# EAGLE design Pawmeat_Ton (EAGLE 9.6.2)
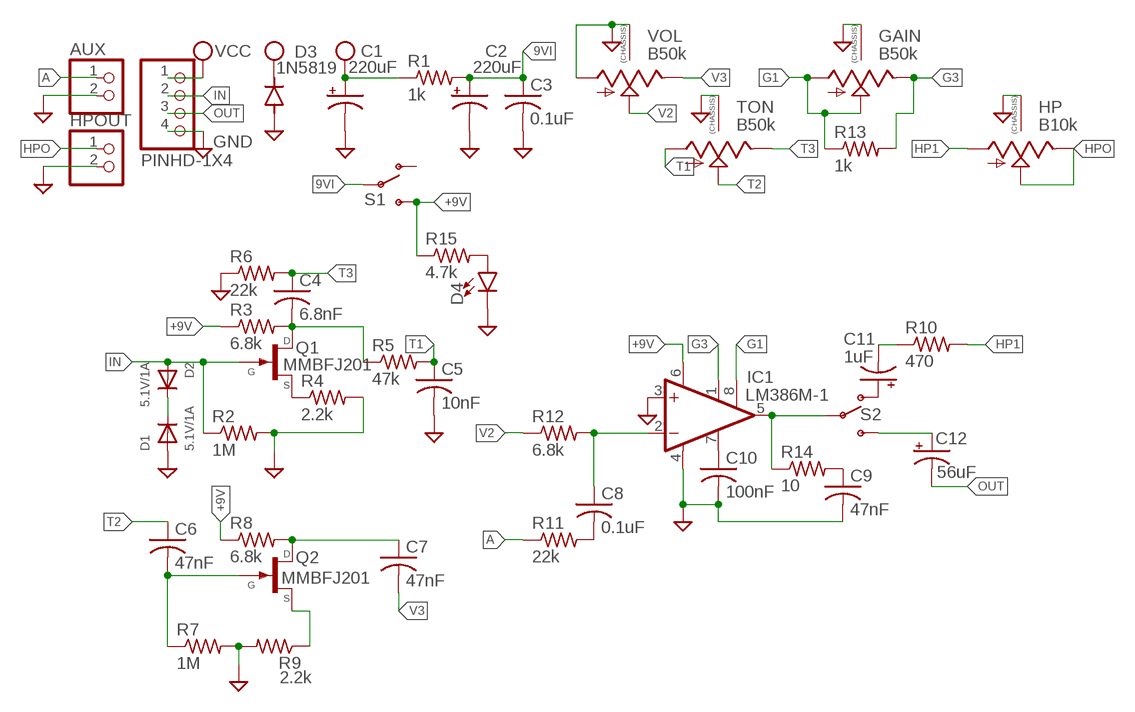
[diagram p0: schematic, sheet 1]

## Parts
AUX  PINHD-1X2  [1X02]
C1  220uF  CAP_SMD+THRUPAN_B  [PAN_B_SMD+THRU]
C2  220uF  CAP_SMD+THRUPAN_B  [PAN_B_SMD+THRU]
C3  0.1uF  C-USC0402  [C0402]
C4  6.8nF  C-USC0402  [C0402]
C5  10nF  C-USC0402  [C0402]
C6  47nF  C-USC0402  [C0402]
C7  47nF  C-USC0402  [C0402]
C8  0.1uF  C-USC0402  [C0402]
C9  47nF  C-USC0402  [C0402]
C10  100nF  C-USC0402  [C0402]
C11  1uF  CAP_SMD+THRUPAN_B  [PAN_B_SMD+THRU]
C12  56uF  CAP_SMD+THRUPAN_B  [PAN_B_SMD+THRU]
D1  5.1V/1A  DIODESMA  [SMADIODE]
D2  5.1V/1A  DIODESMA  [SMADIODE]
D3  1N5819  DIODE-SOD123  [SOD123]
D4  LED0603  [LED-0603]
GAIN  B50k  9MM_SNAP-IN_POT_CHASSIS  [9MM_SNAP-IN_POT]
HP  B10k  9MM_SNAP-IN_POT_CHASSIS  [9MM_SNAP-IN_POT]
HPOUT  PINHD-1X2  [1X02]
IC1  LM386M-1  [SO08]
JP1  PINHD-1X4  [1X04]
Q1  MMBFJ201  MMBF5457  [SOT23]
Q2  MMBFJ201  MMBF5457  [SOT23]
R1  1k  R-US_R0402  [R0402]
R2  1M  R-US_R0402  [R0402]
R3  6.8k  R-US_R0402  [R0402]
R4  2.2k  R-US_R0402  [R0402]
R5  47k  R-US_R0402  [R0402]
R6  22k  R-US_R0402  [R0402]
R7  1M  R-US_R0402  [R0402]
R8  6.8k  R-US_R0402  [R0402]
R9  2.2k  R-US_R0402  [R0402]
R10  470  R-US_R0402  [R0402]
R11  22k  R-US_R0402  [R0402]
R12  6.8k  R-US_R0402  [R0402]
R13  1k  R-US_R0402  [R0402]
R14  10  R-US_R0402  [R0402]
R15  4.7k  R-US_R0402  [R0402]
S1  SWITCH-SPDTSMD2  [SWITCH-SPDT-SMD]
S2  SWITCH-SPDTSMD2  [SWITCH-SPDT-SMD]
TON  B50k  9MM_SNAP-IN_POT_CHASSIS  [9MM_SNAP-IN_POT]
VOL  B50k  9MM_SNAP-IN_POT_CHASSIS  [9MM_SNAP-IN_POT]

## Nets
9VI: C2.+ C2.++(+) C3.1 R1.2 S1.2(P)
+9V: IC1.6(VS) R3.1 R8.1 R15.1 S1.3(S)
A: AUX.1 R11.1
G1: GAIN.1(A) GAIN.2(S) IC1.8(GAIN) R13.1
G3: GAIN.3(E) IC1.1(GAIN) R13.2
GND: AUX.2 C1.- C1.--(-) C2.- C2.--(-) C3.2 C5.2 C9.2 C10.2 D1.A D3.A D4.C GAIN.CHASSIS1 GAIN.CHASSIS2 HP.CHASSIS1 HP.CHASSIS2 HPOUT.2 IC1.3(+IN) IC1.4(GND) JP1.4 R2.2 R4.2 R6.1 R7.2 R9.2 TON.CHASSIS1 TON.CHASSIS2 VOL.1(A) VOL.CHASSIS1 VOL.CHASSIS2
HP1: HP.1(A) R10.2
HPO: HP.2(S) HP.3(E) HPOUT.1
IN: D2.A JP1.2 Q1.3(G) R2.1
N$1: C4.2 Q1.1(D) R3.2 R5.1
N$2: D1.C D2.C
N$3: Q1.2(S) R4.1
N$4: C6.2 Q2.3(G) R7.1
N$5: Q2.2(S) R9.1
N$6: C7.1 Q2.1(D) R8.2
N$7: C8.2 R11.2
N$8: C8.1 IC1.2(-IN) R12.2
N$9: C10.1 IC1.7(BYPASS)
N$10: C9.1 R14.2
N$11: C12.+ C12.++(+) S2.3(S)
N$12: IC1.5(OUT) R14.1 S2.2(P)
N$13: C11.+ C11.++(+) S2.1(O)
N$14: C11.- C11.--(-) R10.1
N$15: D4.A R15.2
OUT: C12.- C12.--(-) JP1.3
T1: C5.1 R5.2 TON.1(A)
T2: C6.1 TON.2(S)
T3: C4.1 R6.2 TON.3(E)
V2: R12.1 VOL.2(S)
V3: C7.2 VOL.3(E)
VCC: C1.+ C1.++(+) D3.C JP1.1 R1.1
Unconnected: S1.1(O)

## Library data of the parts
AUX HPOUT = pinhead:PINHD-1X2: PIN HEADER
C1 C2 C11 C12 = MusicThingModular:CAP_SMD+THRU
C3-C10 = adafruit:C-US: CAPACITOR, American symbol
D1 D2 = adafruit:DIODE: Diode SMADIODE - SMA Surface Mount Package 20V 1A Schottky Diode Digikey: 641-1014-6-ND DO-1N4148 - Through Hole Small Current Diode SOD-123 20V 1 A (.5mV Vf) Schottky Diode - Digikey: MBRX120TPMSCT-ND SOD-323 10V 570mA (.38mV Vf, 3ns) Schottky Diode - Digikey: ZLLS410CT-ND SOD-523 30V 30mA Schottky Diode (RB751S-40TE61) - Digikey: RB751S-40TE61CT-ND SOT23-R/W - SOT23 Package (R = Solder Paste/Reflow Ovens, W = Hand-Soldering) BAT54Film 40V 300mA - Digikey: 497-7162-1-ND
D3 = diode:DIODE-: DIODE
D4 = SparkFun-LED:LED: LED (Generic) Standard schematic elements and footprints for 5mm, 3mm, 1206, and 0603 sized LEDs. Generic LEDs with no color specified.
GAIN HP TON VOL = MusicThingModular:9MM_SNAP-IN_POT_CHASSIS: 9mm vertical snap-in pot, Alpha / Panasonic style, with a connection to the metal chassis for grounding
IC1 = linear:LM386?-*: Low Voltage Audio Power Amplifier Source: http://cache.national.com/ds/LM/LM386.pdf
JP1 = Connector:PINHD-1X4: PIN HEADER; CATEGORY: CONNECTOR; SUB-CATEGORY: PIN-HEADER
Q1 Q2 = MMBF5457:MMBF5457*: N-Channel JFET; AVAILABILITY: Unavailable; DESCRIPTION: JFET N-Channel 25V 350mW Surface Mount SOT-23-3; MF: ON Semiconductor; MP: MMBF5457; PACKAGE: SOT-23-3 Fairchild Semiconductor; PRICE: None
R1-R15 = adafruit:R-US_: RESISTOR, American symbol
S1 S2 = SparkFun-Electromechanical:SWITCH-SPDT: SPDT Switch Simple slide switch, Spark Fun Electronics SKU : COM-00102 DPDT SMT slide switch, AYZ0202, SWCH-08179

## Board
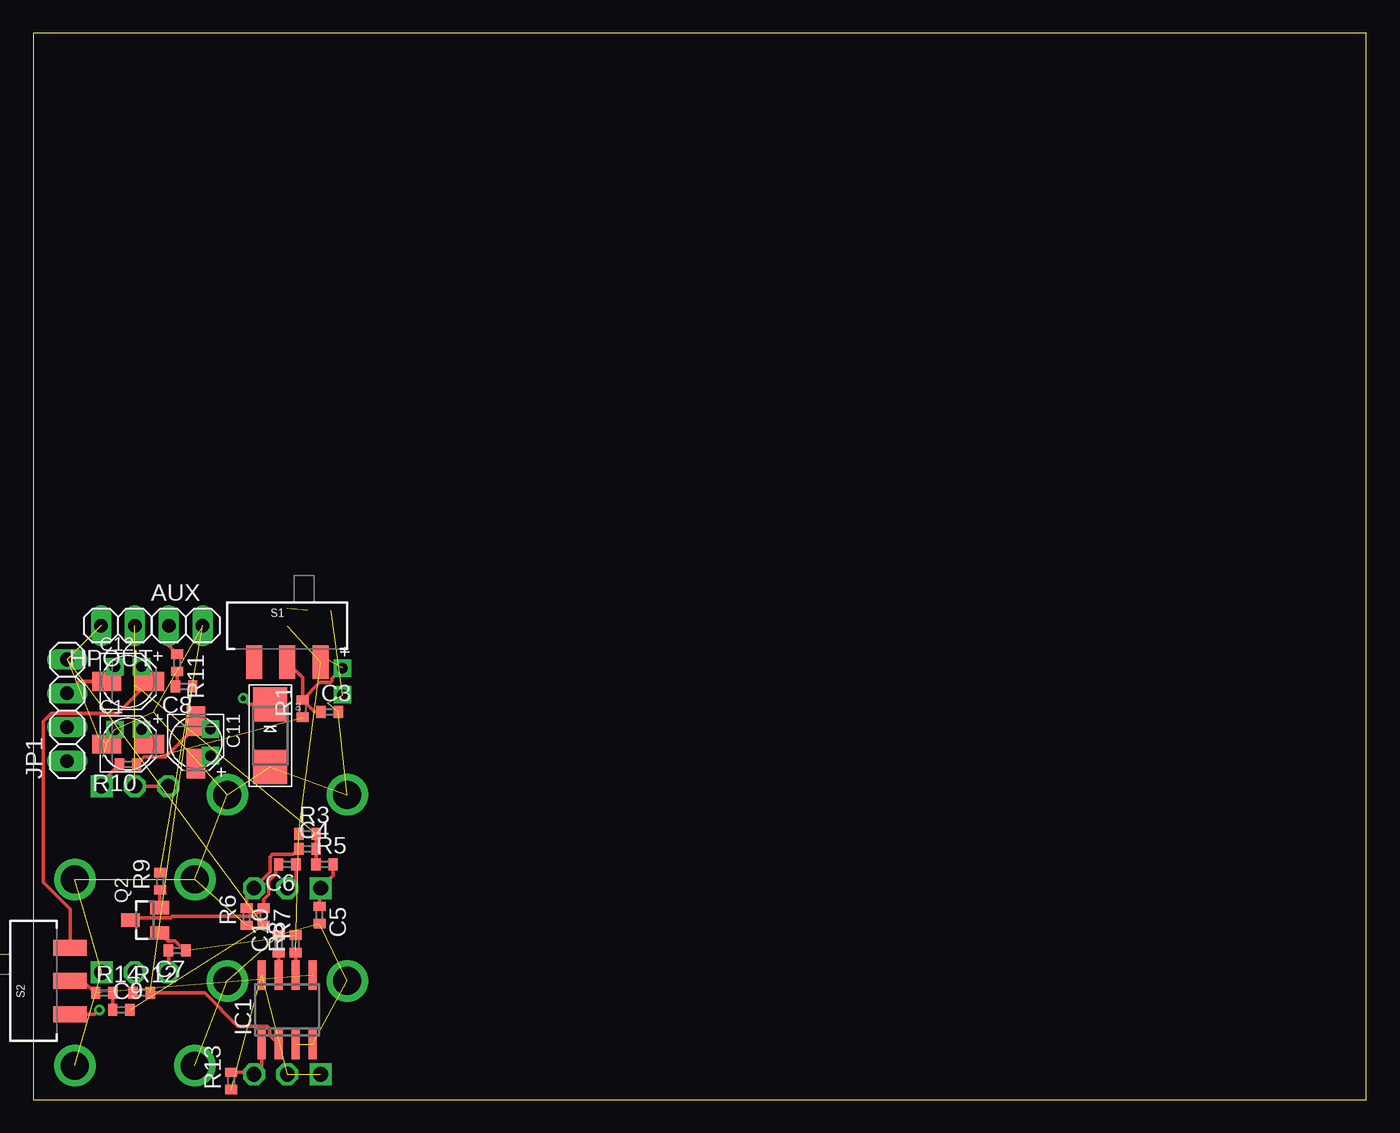
[diagram p1: board, top side]
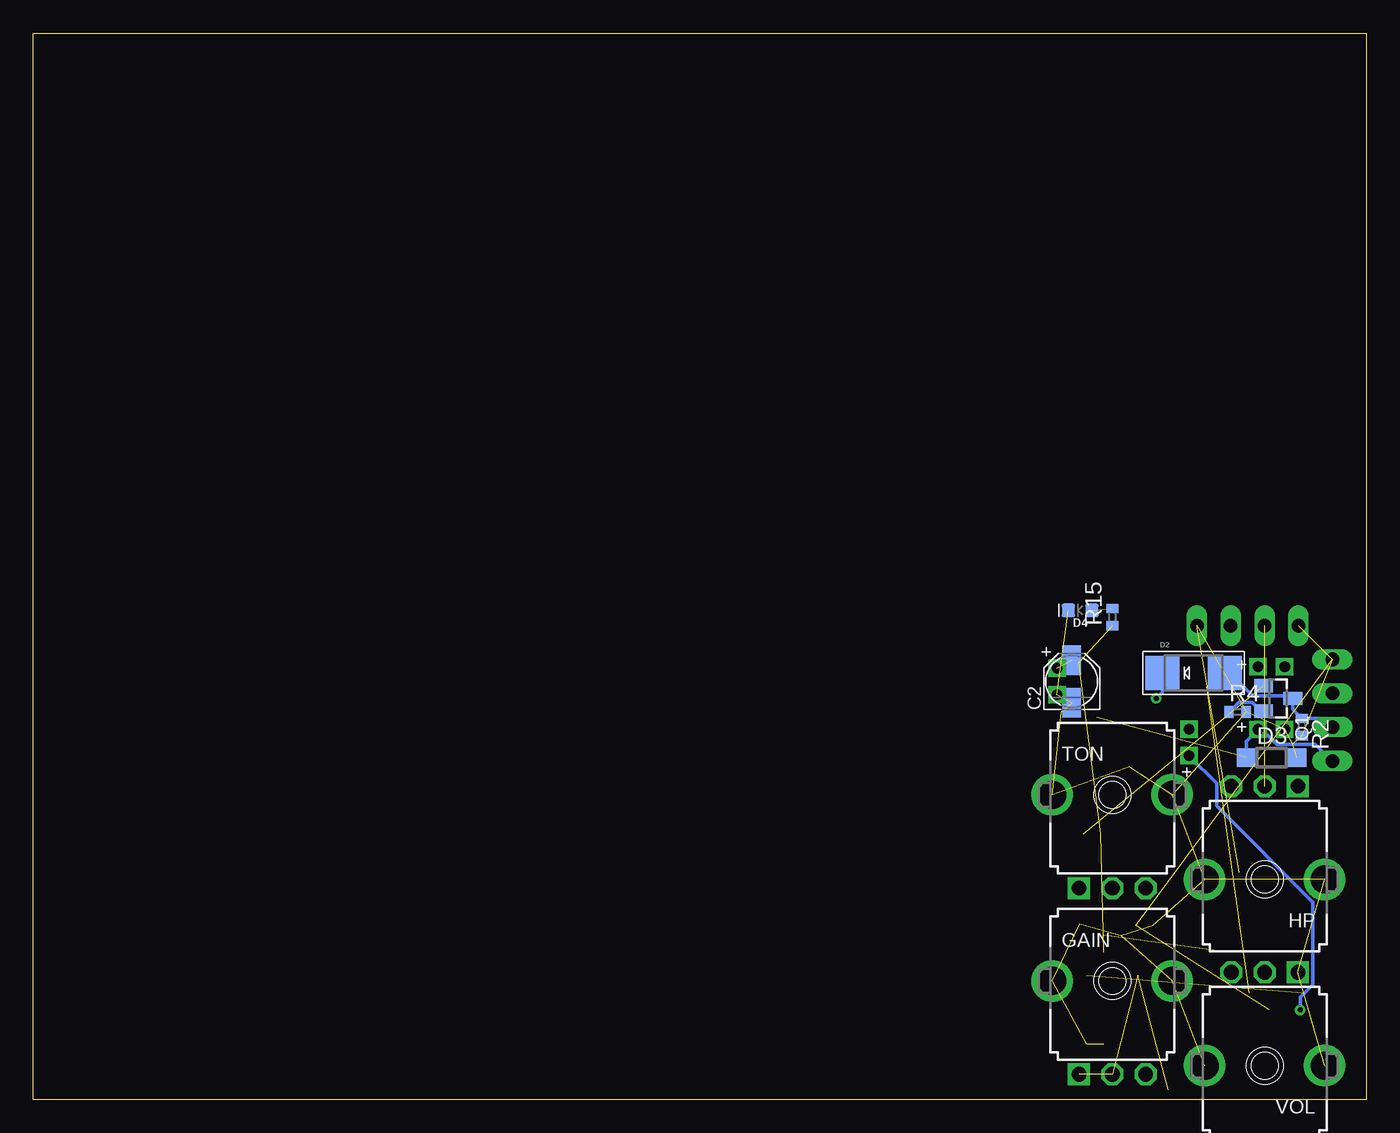
[diagram p2: board, bottom side, seen from below]

Size 100 x 80 mm. Coordinates in mm from the lower left corner, seen from the top.
Outline: 0,0 100,0 100,80 0,80 0,0
Copper layers (1*16): Top 0.035mm / dielectric 1.5mm / Bottom 0.035mm
Design rules "default *": minimum track width 6mil, minimum drill 0.35mm, track to track 6mil, track to pad 6mil, pad to pad 6mil, via to via 6mil, smd to smd 6mil, copper to edge 10mil, drill to drill 6mil, minimum pad ring 10mil, minimum via ring 8mil, stop-mask expansion 4mil, vias tented up to drill 0mil, thermal gap 10mil

### Footprints (pad centres in the part's own frame; a part is rotated, then mirrored left to right if it is on the bottom)
1X02 = drill 1.016 long: 1 -1.27,0; 2 1.27,0
PAN_B_SMD+THRU = smd 2.2 x 1.4: + 1.6,0; - -1.6,0 | drill 0.8 pad 0.9 square: ++ 1,1.1; -- -1,1.1
C0402 = smd 0.7 x 0.9: 1 -0.65,0; 2 0.65,0
SMADIODE = smd 2.54 x 2.54: A 2.349,0; C -2.349,0
SOD123 = smd 1.4 x 1.4: A 1.9,0; C -1.9,0
LED-0603 = smd 1 x 1: A -0.877,0; C 0.877,0
9MM_SNAP-IN_POT = drill 1.1 square: 1 -2.5,-7 | drill 1.1 octagon: 2 0,-7; 3 2.5,-7 | drill 2.1 pad 2.794: CHASSIS1 -4.5,0; CHASSIS2 4.5,0
SO08 = smd 0.6 x 2.2: 1 -1.905,-2.6; 2 -0.635,-2.6; 3 0.635,-2.6; 4 1.905,-2.6; 5 1.905,2.6; 6 0.635,2.6; 7 -0.635,2.6; 8 -1.905,2.6
1X04 = drill 1.016 long: 1 -3.81,0; 2 -1.27,0; 3 1.27,0; 4 3.81,0
SOT23 = smd 1 x 1.4: 1 -0.95,-1.1; 2 0.95,-1.1; 3 0,1.1
R0402 = smd 0.7 x 0.9: 1 -0.65,0; 2 0.65,0
SWITCH-SPDT-SMD = smd 1.2 x 2.5: 1 -2.5,-2.75; 2 0,-2.75; 3 2.5,-2.75

### Placement (x,y rotation side)
AUX  11.43,35.56 0 top
C1  7.11,26.67 0 top
C2  22.1,31.37 90 bottom
C3  22.23,29.08 0 top
C4  20.57,18.8 0 top
C5  21.46,13.84 270 top
C6  19.05,17.65 180 top
C7  10.79,11.18 180 top
C8  11.3,30.99 180 top
C9  6.6,6.73 0 top
C10  18.41,11.68 90 top
C11  12.19,26.8 270 top
C12  7.11,31.37 0 top
D1  17.78,27.3 270 top
D2  12.95,32 0 bottom
D3  7.11,25.65 0 bottom
D4  21.46,36.7 180 bottom
GAIN  19.05,8.89 0 bottom
HP  7.62,16.51 180 bottom
HPOUT  6.35,35.56 180 top
IC1  19.05,6.73 0 top
JP1  2.54,29.21 90 top
Q1  6.6,30.1 270 bottom
Q2  8.38,13.46 90 top
R1  20.19,29.34 90 top
R2  4.83,27.94 270 bottom
R3  20.57,19.94 0 top
R4  9.65,29.08 0 bottom
R5  21.84,17.65 0 top
R6  16,13.72 90 top
R7  17.27,13.72 270 top
R8  19.68,11.68 90 top
R9  9.53,16.38 90 top
R10  7.11,25.15 180 top
R11  10.79,32.77 270 top
R12  8.13,8 0 top
R13  14.86,1.4 90 top
R14  5.33,8 0 top
R15  19.05,36.2 90 bottom
S1  19.05,35.56 0 top
S2  0,8.89 90 top
TON  19.05,22.86 0 bottom
VOL  7.62,2.54 180 bottom

### Tracks (layer width: path | path; a pad name or v marks a point on that pad's centre or on a via)
9VI  (1 unrouted)
  Top 0.254: R1.2 20.19,31.67 S1.2 | R1.2 21.1,29.08 C3.1 | R1.2 21.49,31.28 22.27,31.28 22.43,31.44 22.43,31.6 C2.++
+9V  (3 unrouted)
  Top 0.254: IC1.6 R8.1
A
  Top 0.254: R11.1 10.16,34.05 AUX.1
G1  (3 unrouted)
G3
  Top 0.254: R13.2 16.39,2.05 GAIN.3 17.14,2.48 IC1.1
GND  (29 unrouted)
HP1
  Top 0.254: R10.2 5.12,23.8 HP.1
HPO  (1 unrouted)
  Top 0.254: HP.3 HP.2
IN
  Bottom 0.254: JP1.2 3.19,28.59 R2.1 5.5,29.27 Q1.3 5.67,30.27 8.52,30.27 10.25,32 D2.A
N$1  (1 unrouted)
  Top 0.254: R5.1 21.22,17.68 C4.2 R3.2
N$2  (via drill 0.38)
  Top 0.254: D1.C 16.19,29.65 v15.75,30.1
  Bottom 0.254: v15.75,30.1 15.3,30.54 D2.C
N$3
  Bottom 0.254: Q1.2 7.87,29.15 8.54,29.81 9.57,29.81 R4.1
N$4
  Top 0.254: C6.2 18.18,17.43 18.18,16.91 17.65,16.39 17.65,15.4 17.27,15.02 R7.1 17.2,14.37 16.57,13.74 10.4,13.74 10.3,13.63 7.45,13.63 Q2.3
N$5
  Top 0.254: R9.1 9.48,15.69 Q2.2
N$6  (1 unrouted)
  Top 0.254: Q2.1 10.09,11.9 10.61,11.9 11.34,11.18 C7.1
N$7
  Top 0.254: R11.2 10.79,31.13 C8.2
N$8  (1 unrouted)
  Top 0.254: R12.2 12.84,8 15.33,5.51 17.56,5.51 17.72,5.35 17.72,4.82 IC1.2
N$9
  Top 0.254: IC1.7 C10.1
N$10
  Top 0.254: C9.1 5.95,7.97 R14.2
N$11
  Top 0.254: C12.++ 8.71,31.87 C12.+ 6.32,28.98 1.35,28.98 0.74,28.37 0.74,16.3 2.75,14.28 S2.3
N$12  (1 unrouted)
  Top 0.254: R14.1 4.25,8.44 4.18,8.44 3.73,8.89 S2.2
N$13  (via drill 0.38)
  Top 0.254: C11.+ 12.79,25.8 C11.++ | S2.1 4.61,6.39 v4.95,6.73
  Bottom 0.254: C11.++ 11.22,23.73 11.22,22.02 4.02,14.81 4.02,8.6 4.95,7.66 v4.95,6.73
N$14
  Top 0.254: C11.- 12.63,28.4 | C11.-- 12.69,28.4 12.63,28.4 | R10.1 8.31,25.69 9.93,25.69 12.63,28.4
N$15  (1 unrouted)
OUT
  Top 0.254: C12.-- 6.11,31.97 C12.- 3.43,31.37 JP1.3
T1
  Top 0.254: R5.2 22.49,16.8 TON.1 21.46,15.77 C5.1
T2
  Top 0.254: C6.1 19.7,16.51 TON.2
T3
  Top 0.254: C4.1 19.51,18.38 17.93,18.38 17.77,18.22 17.77,17.08 TON.3 16,15.31 R6.2
V2
  Top 0.254: R12.1 7.48,9.4 VOL.2
V3
  Top 0.254: C7.2 10.14,9.56 VOL.3
VCC  (1 unrouted)
  Top 0.254: C1.++ 8.71,27.17 C1.+
  Bottom 0.254: JP1.1 3.8,26.66 6.71,26.66 7.82,27.77 C1.++ 9.01,26.87 D3.C